# Altium project Cuk_3Ph_Control.PrjPcb
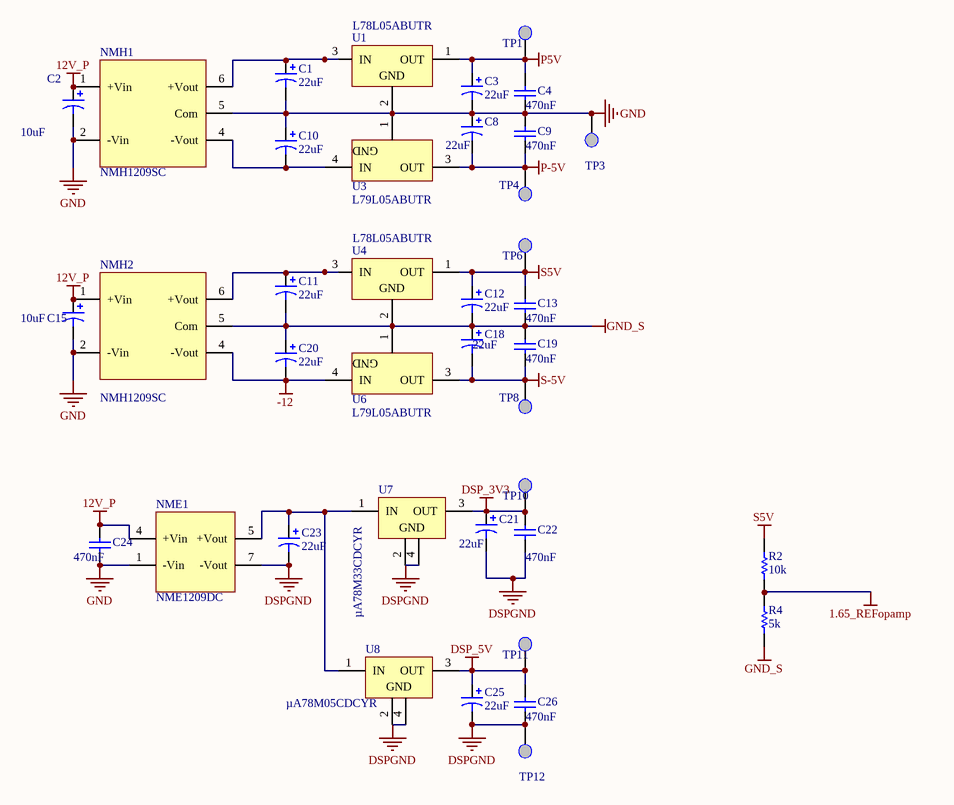
[diagram p0: CUK_3Ph_Power_Supplys.SchDoc]
5 sheets, 204 parts. Net scope: flat (ports and power ports of the same name join across sheets).
Board file: cuk_control_pcb_grid_connected.PcbDoc
Sheets:
  CUK_3Ph_Power_Supplys.SchDoc
  CUK_3Ph_sig_conditioner.SchDoc
  CUK_3Ph_Analog_Isolation.SchDoc
  DAC.SchDoc
  CUK_3Ph_dig_iso_interface.SchDoc

## Sheet CUK_3Ph_Power_Supplys.SchDoc: Cux GaN Grid connected control board
size A; Engineer: Ankit Gupta; Revision: V1.1

### Parts
C1  value 22uF  [Cap tantal 22u-25V]  (hidden comment: Tantalium)
C2  value 10uF  [CAP-10u-16V]  (hidden comment: electrolytic)
C3  value 22uF  [Cap Tantal 3216]  (hidden comment: Tantalium/T520A226M006ATE090)
C4  value 470nF  [Capacitor 0805]  (hidden comment: Cap)
C8  value 22uF  [Cap Tantal 3216]  (hidden comment: Tantalium/T520A226M006ATE090)
C9  value 470nF  [Capacitor 0805]  (hidden comment: Cap)
C10  value 22uF  [Cap tantal 22u-25V]  (hidden comment: Tantalium)
C11  value 22uF  [Cap tantal 22u-25V]  (hidden comment: Tantalium)
C12  value 22uF  [Cap Tantal 3216]  (hidden comment: Tantalium/T520A226M006ATE090)
C13  value 470nF  [Capacitor 0805]  (hidden comment: Cap)
C15  value 10uF  [Cap elec 10u/16V]  (hidden comment: electrolytic)
C18  value 22uF  [Cap Tantal 3216]  (hidden comment: Tantalium/T520A226M006ATE090)
C19  value 470nF  [Capacitor 0805]  (hidden comment: Cap)
C20  value 22uF  [Cap tantal 22u-25V]  (hidden comment: Tantalium)
C21  value 22uF  [Cap Tantal 3216]  (hidden comment: Tantalium/T520A226M006ATE090)
C22  value 470nF  [Capacitor 0805]  (hidden comment: Cap)
C23  value 22uF  [Cap tantal 22u-25V]  (hidden comment: Tantalium)
C24  value 470nF  [Capacitor 0805]  (hidden comment: Cap)
C25  value 22uF  [Cap Tantal 3216]  (hidden comment: Tantalium/T520A226M006ATE090)
C26  value 470nF  [Capacitor 0805]  (hidden comment: Cap)
NME1  NME1209DC  [NME1209DC]
NMH1  NMH1209SC  [NMH1209SC]
NMH2  NMH1209SC  [NMH1209SC]
R2  value 10k  [0805 RES]  (hidden comment: Res1)
R4  value 5k  [0805 RES]  (hidden comment: Res1)
TP1  Test point  [Test Point]  (value not drawn)
TP3  Test point  [Test Point]  (value not drawn)
TP4  Test point  [Test Point]  (value not drawn)
TP6  Test point  [Test Point]  (value not drawn)
TP8  Test point  [Test Point]  (value not drawn)
TP10  Test point  [Test Point]  (value not drawn)
TP11  Test point  [Test Point]  (value not drawn)
TP12  Test point  [Test Point]  (value not drawn)
U1  L78L05ABUTR  [Reg SOT-89 +5]
U3  L79L05ABUTR  [Reg SOT-89]
U4  L78L05ABUTR  [Reg SOT-89 +5]
U6  L79L05ABUTR  [Reg SOT-89]
U7  µA78M33CDCYR  [Reg - SOT223]
U8  µA78M05CDCYR  [Reg - SOT223]

### Nets
1.65_REFopamp: R2.1 R4.2
12V_P: C2.1 C15.1 C24.2 NME1.4(+Vin) NMH1.1(+Vin) NMH2.1(+Vin)
-12: C20.2 NMH2.4(-Vout) U6.4(IN)
DSP_3V3: C21.1 C22.2 TP10.1 U7.3(OUT)
DSP_5V: C25.1 C26.2 TP11.1 U8.3(OUT)
DSPGND: C21.2 C22.1 C23.2 C25.2 C26.1 NME1.7(-Vout) TP12.1 U7.2(GND) U7.4(GND) U8.2(GND) U8.4(GND)
GND: C1.2 C2.2 C3.2 C4.1 C8.1 C9.2 C10.1 C15.2 C24.1 NME1.1(-Vin) NMH1.2(-Vin) NMH1.5(Com) NMH2.2(-Vin) TP3.1 U1.2(GND) U3.1(GND)
GND_S: C11.2 C12.2 C13.1 C18.1 C19.2 C20.1 NMH2.5(Com) R4.1 U4.2(GND) U6.1(GND)
P5V: C3.1 C4.2 TP1.1 U1.1(OUT)
P-5V: C8.2 C9.1 TP4.1 U3.3(OUT)
S5V: C12.1 C13.2 R2.2 TP6.1 U4.1(OUT)
S-5V: C18.2 C19.1 TP8.1 U6.3(OUT)
NetC1_1: C1.1 NMH1.6(+Vout) U1.3(IN)
NetC10_2: C10.2 NMH1.4(-Vout) U3.4(IN)
NetC11_1: C11.1 NMH2.6(+Vout) U4.3(IN)
NetC23_1: C23.1 NME1.5(+Vout) U7.1(IN) U8.1(IN)

### Library data of the parts
C1-C3 C8 C10-C12 C15 C18 C20 C21 C23 C25 = Cap Pol1: Polarized Capacitor (Radial); Published: 8-Jun-2000; LatestRevisionDate: 17-Jul-2002; LatestRevisionNote: Re-released for DXP Platform.; PackageReference: RB7.6-15; Publisher: Altium Limited
C4 C9 C13 C19 C22 C24 C26 = Cap: Capacitor; Published: 8-Jun-2000; LatestRevisionDate: 17-Jul-2002; LatestRevisionNote: Re-released for DXP Platform.; PackageReference: RAD-0.3; Publisher: Altium Limited
NME1 = NME----DC
NMH1 = NMH----SC_1
NMH2 = NMH----SC
R2 R4 = Res1: Resistor; Published: 8-Jun-2000; LatestRevisionDate: 17-Jul-2002; LatestRevisionNote: Re-released for DXP Platform.; PackageReference: AXIAL-0.3; Publisher: Altium Limited
U1 U4 = L78L05ABZ: Positive Voltage Regulator; Published: 24-Aug-2001; LatestRevisionDate: 17-Jul-2002; LatestRevisionNote: Re-released for DXP Platform.; DatasheetVersion: Feb-1999; PackageReference: TO92; Publisher: Altium Limited; PackageDescription: TO, Flat Index; 3 In-Line, Axial Leads; Body Dia. 4.8mm; Leads 0.51 x 0.51 mm (max); ComponentLink1Description: Manufacturer Link; ComponentLink1URL: http://www.st.com/
U3 U6 = µA79M05CKTPR: Negative-Voltage Regulator; Note: Pin 2 is electrically connected to pin4, and not drawn.; Published: 15-Apr-2002; DatasheetVersion: Apr-2000; PackageVersion: Jan-2001; PackageReference: KTP02; Publisher: Altium Limited; PackageDescription: PowerFLEX (D-PAK/TO-252-AA); 3 Leads (1 Cropped); Body 9.7 (inc. leads) x 6.2 mm (LxW max); Code_JEDEC: TO-252; ComponentLink1Description: Manufacturer Link; ComponentLink1URL: http://www.ti.com/; ComponentLink2Description: Datasheet; ComponentLink2URL: http://www-s.ti.com/sc/ds/ua79m05.pdf
U7 U8 = µA7805CKTER: Positive-Voltage Regulator; Note: Pin 2 is electrically connected to TAB/Pin4.; Published: 15-Apr-2002; DatasheetVersion: Jul-1999; PackageVersion: Jan-2001; PackageReference: KTE03; Publisher: Altium Limited; PackageDescription: PowerFLEX; 3 Leads; Body 10.7 (inc. leads) x 9.5 mm (LxW max); Code_JEDEC: MO-169; ComponentLink1Description: Manufacturer Link; ComponentLink1URL: http://www.ti.com/; ComponentLink2Description: Datasheet; ComponentLink2URL: http://www-s.ti.com/sc/ds/ua7805.pdf

## Sheet CUK_3Ph_sig_conditioner.SchDoc
size A
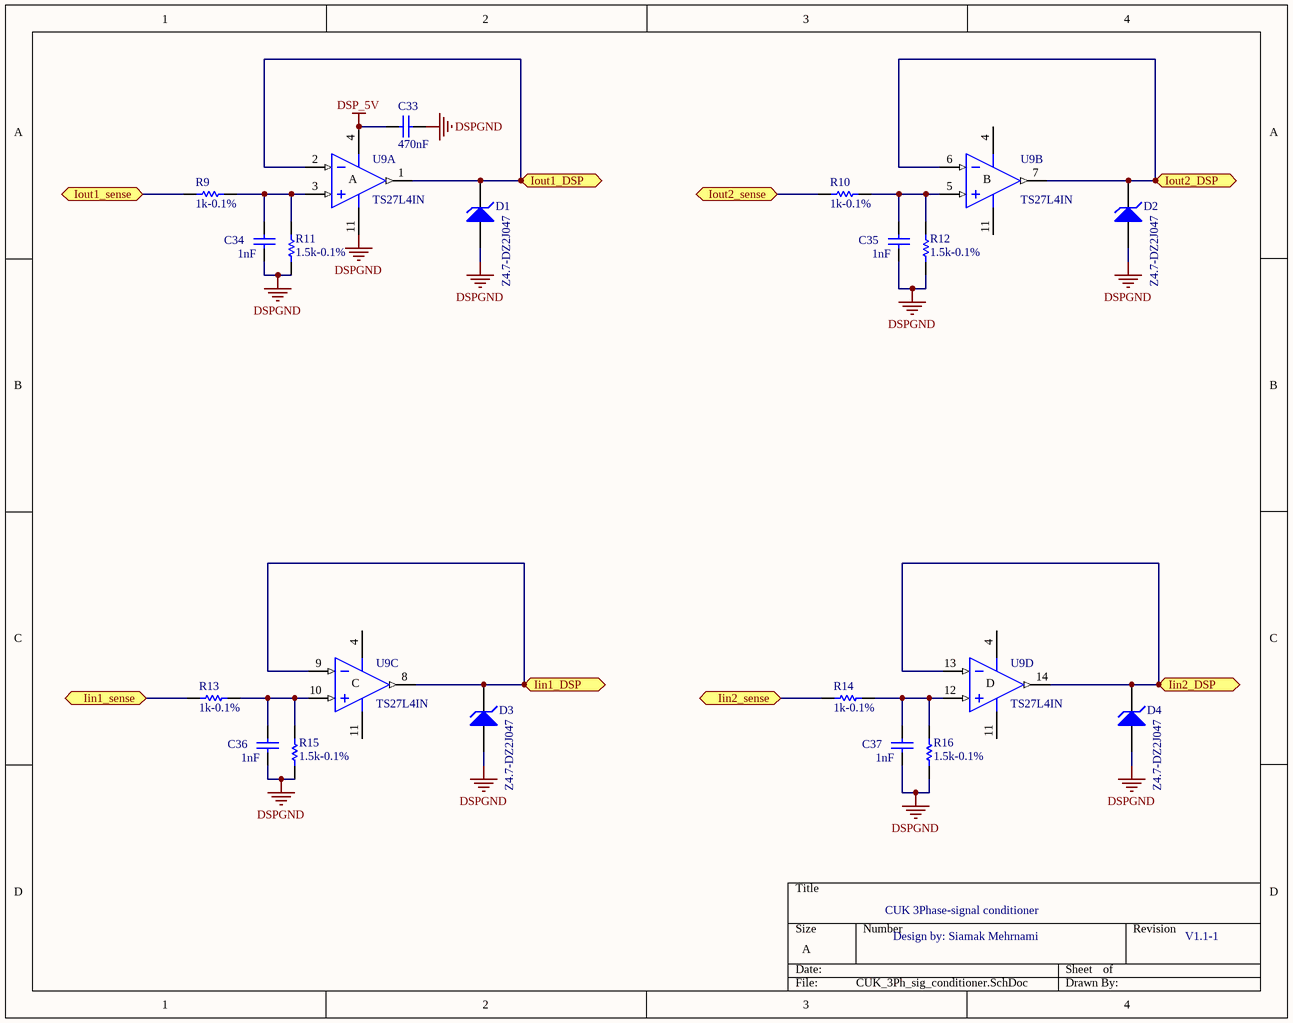
[diagram p1: CUK_3Ph_sig_conditioner.SchDoc]

### Parts
C33  value 470nF  [Capacitor 0805]  (hidden comment: Cap)
C34  value 1nF  [Capacitor 0805]  (hidden comment: Cap)
C35  value 1nF  [Capacitor 0805]  (hidden comment: Cap)
C36  value 1nF  [Capacitor 0805]  (hidden comment: Cap)
C37  value 1nF  [Capacitor 0805]  (hidden comment: Cap)
D1  Z4.7-DZ2J047  [Zener DZ2J047]
D2  Z4.7-DZ2J047  [Zener DZ2J047]
D3  Z4.7-DZ2J047  [Zener DZ2J047]
D4  Z4.7-DZ2J047  [Zener DZ2J047]
R9  value 1k-0.1%  [0805 RES]  (hidden comment: Res1)
R10  value 1k-0.1%  [0805 RES]  (hidden comment: Res1)
R11  value 1.5k-0.1%  [0805 RES]  (hidden comment: Res1)
R12  value 1.5k-0.1%  [0805 RES]  (hidden comment: Res1)
R13  value 1k-0.1%  [0805 RES]  (hidden comment: Res1)
R14  value 1k-0.1%  [0805 RES]  (hidden comment: Res1)
R15  value 1.5k-0.1%  [0805 RES]  (hidden comment: Res1)
R16  value 1.5k-0.1%  [0805 RES]  (hidden comment: Res1)
U9  TS27L4IN  [DIP14]  (parts A,B,C,D of 4)

### Ports
Iin1_DSP, Iin1_sense, Iin2_DSP, Iin2_sense, Iout1_DSP, Iout1_sense (bidir), Iout2_DSP, Iout2_sense (bidir)

### Nets
DSP_5V: C33.2 U9.4(V+)
DSPGND: C33.1 C34.1 C35.1 C36.1 C37.1 D1.1(A) D2.1(A) D3.1(A) D4.1(A) R11.1 R12.1 R15.1 R16.1 U9.11(V-)
NetC34_2: C34.2 R9.1 R11.2 U9.3(IN+)
NetC35_2: C35.2 R10.1 R12.2 U9.5(IN+)
NetC36_2: C36.2 R13.1 R15.2 U9.10(IN+)
NetC37_2: C37.2 R14.1 R16.2 U9.12(IN+)
NetD1_2: D1.2(K) U9.1(OUT) U9.2(IN-) ; port Iout1_DSP
NetD2_2: D2.2(K) U9.6(IN-) U9.7(OUT) ; port Iout2_DSP
NetD3_2: D3.2(K) U9.8(OUT) U9.9(IN-) ; port Iin1_DSP
NetD4_2: D4.2(K) U9.13(IN-) U9.14(OUT) ; port Iin2_DSP
NetP2_5: R13.2 ; port Iin1_sense
NetP2_7: R14.2 ; port Iin2_sense
NetP2_9: R9.2 ; port Iout1_sense
NetP2_11: R10.2 ; port Iout2_sense

### Notes on the sheet
- CUK 3Phase-signal conditioner
- Design by: Siamak Mehrnami
- V1.1-1
- (in symbol TS27L4AMD, part A) A
- (in symbol TS27L4AMD, part B) B
- (in symbol TS27L4AMD, part C) C
- (in symbol TS27L4AMD, part D) D

### Library data of the parts
C33-C37 = Cap: Capacitor; Published: 8-Jun-2000; LatestRevisionDate: 17-Jul-2002; LatestRevisionNote: Re-released for DXP Platform.; PackageReference: RAD-0.3; Publisher: Altium Limited
D1-D4 = D Zener: Zener Diode; Published: 8-Jun-2000; LatestRevisionDate: 17-Jul-2002; LatestRevisionNote: Re-released for DXP Platform.; PackageReference: DIODE-0.7; Publisher: Altium Limited
R9-R16 = Res1: Resistor; Published: 8-Jun-2000; LatestRevisionDate: 17-Jul-2002; LatestRevisionNote: Re-released for DXP Platform.; PackageReference: AXIAL-0.3; Publisher: Altium Limited
U9 = TS27L4AMD: Very Low-Power CMOS Quad Operational Amplifier; Published: 24-Aug-2001; LatestRevisionDate: 13-Apr-2006; LatestRevisionNote: IPC-7351 Footprint Added.; DatasheetVersion: Nov-1998; PackageVersion: Sep-1998; PackageReference: SO14; Publisher: Altium Limited; PackageDescription: 14-Pin Small Outline Integrated Circuit 1.27 mm Pitch; Code_IPC: SOIC127P600-14; ComponentLink1Description: Manufacturer Link; ComponentLink1URL: http://www.st.com/; ComponentLink2Description: Datasheet; ComponentLink2URL: http://www.st.com/stonline/products/literature/ds/2305/ts27l4.pdf

## Sheet CUK_3Ph_Analog_Isolation.SchDoc
size A3
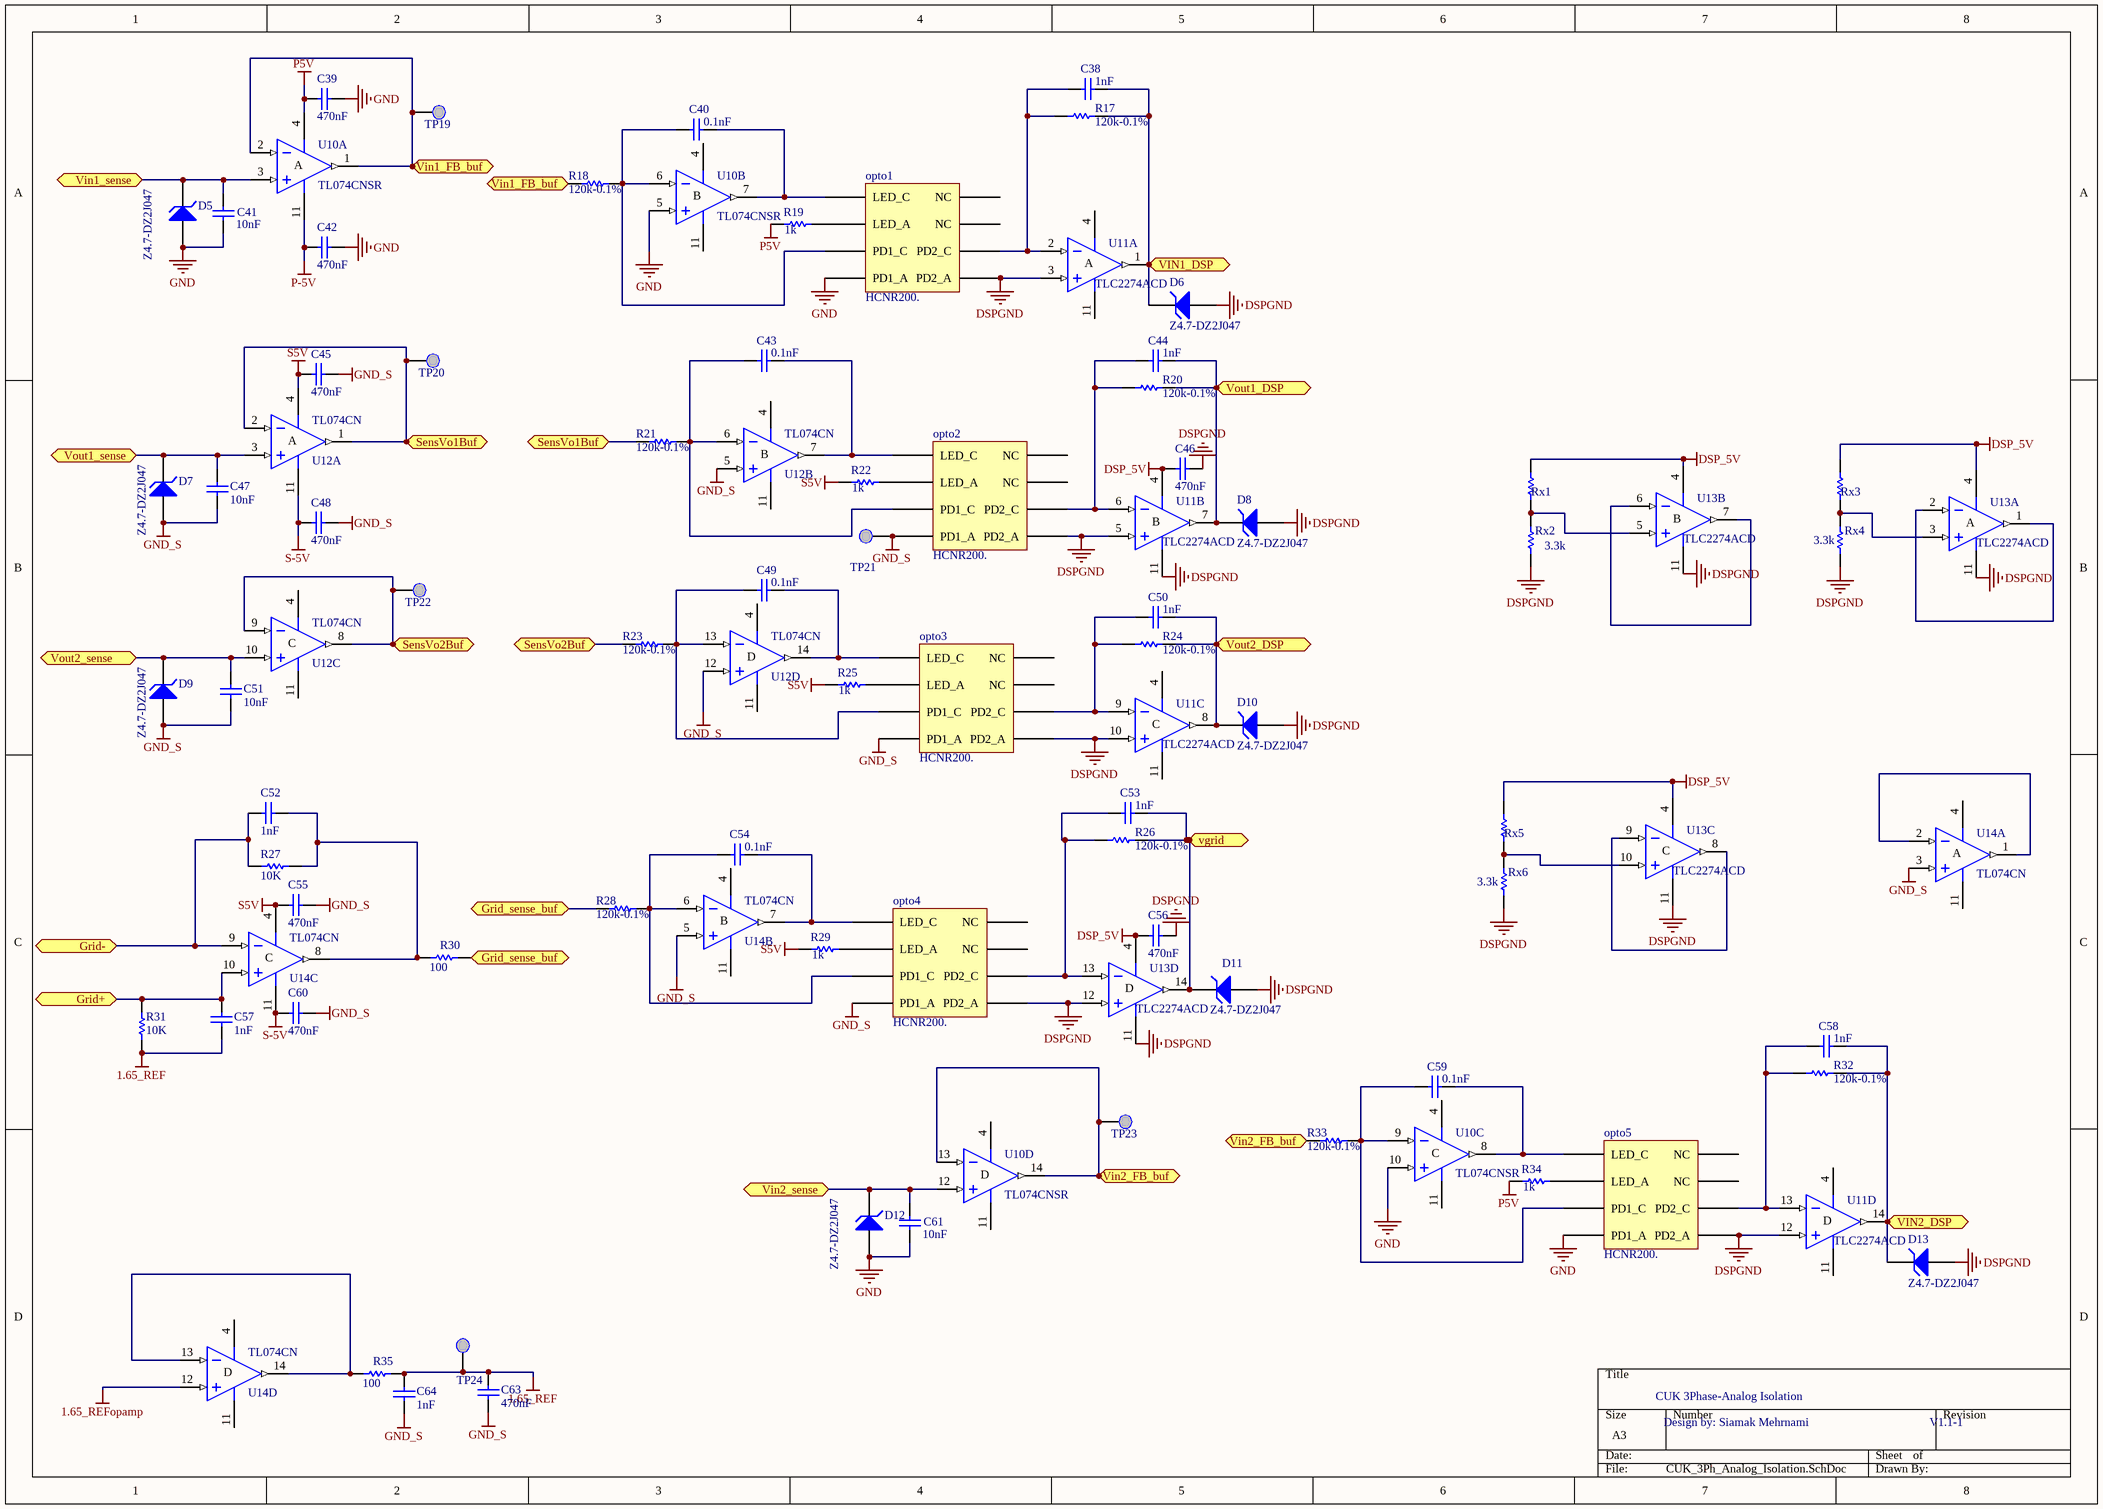
[diagram p2: CUK_3Ph_Analog_Isolation.SchDoc]

### Parts
C38  value 1nF  [Capacitor 0805]  (hidden comment: Cap)
C39  value 470nF  [Capacitor 0805]  (hidden comment: Cap)
C40  value 0.1nF  [Capacitor 0805]  (hidden comment: Cap)
C41  value 10nF  [Capacitor 0805]  (hidden comment: Cap)
C42  value 470nF  [Capacitor 0805]  (hidden comment: Cap)
C43  value 0.1nF  [Capacitor 0805]  (hidden comment: Cap)
C44  value 1nF  [Capacitor 0805]  (hidden comment: Cap)
C45  value 470nF  [Capacitor 0805]  (hidden comment: Cap)
C46  value 470nF  [Capacitor 0805]  (hidden comment: Cap)
C47  value 10nF  [Capacitor 0805]  (hidden comment: Cap)
C48  value 470nF  [Capacitor 0805]  (hidden comment: Cap)
C49  value 0.1nF  [Capacitor 0805]  (hidden comment: Cap)
C50  value 1nF  [Capacitor 0805]  (hidden comment: Cap)
C51  value 10nF  [Capacitor 0805]  (hidden comment: Cap)
C52  value 1nF  [Capacitor 0805]  (hidden comment: Cap)
C53  value 1nF  [Capacitor 0805]  (hidden comment: Cap)
C54  value 0.1nF  [Capacitor 0805]  (hidden comment: Cap)
C55  value 470nF  [Capacitor 0805]  (hidden comment: Cap)
C56  value 470nF  [Capacitor 0805]  (hidden comment: Cap)
C57  value 1nF  [Capacitor 0805]  (hidden comment: Cap)
C58  value 1nF  [Capacitor 0805]  (hidden comment: Cap)
C59  value 0.1nF  [Capacitor 0805]  (hidden comment: Cap)
C60  value 470nF  [Capacitor 0805]  (hidden comment: Cap)
C61  value 10nF  [Capacitor 0805]  (hidden comment: Cap)
C63  value 470nF  [Capacitor 0805]  (hidden comment: Cap)
C64  value 1nF  [Capacitor 0805]  (hidden comment: Cap)
D5  Z4.7-DZ2J047  [Zener DZ2J047]
D6  Z4.7-DZ2J047  [Zener DZ2J047]
D7  Z4.7-DZ2J047  [Zener DZ2J047]
D8  Z4.7-DZ2J047  [Zener DZ2J047]
D9  Z4.7-DZ2J047  [Zener DZ2J047]
D10  Z4.7-DZ2J047  [Zener DZ2J047]
D11  Z4.7-DZ2J047  [Zener DZ2J047]
D12  Z4.7-DZ2J047  [Zener DZ2J047]
D13  Z4.7-DZ2J047  [Zener DZ2J047]
opto1  HCNR200.  [HCNR200]
opto2  HCNR200.  [HCNR200]
opto3  HCNR200.  [HCNR200]
opto4  HCNR200.  [HCNR200]
opto5  HCNR200.  [HCNR200]
R17  value 120k-0.1%  [0805 RES]  (hidden comment: Res1)
R18  value 120k-0.1%  [0805 RES]  (hidden comment: Res1)
R19  value 1k  [0805 RES]  (hidden comment: Res1)
R20  value 120k-0.1%  [0805 RES]  (hidden comment: Res1)
R21  value 120k-0.1%  [0805 RES]  (hidden comment: Res1)
R22  value 1k  [0805 RES]  (hidden comment: Res1)
R23  value 120k-0.1%  [0805 RES]  (hidden comment: Res1)
R24  value 120k-0.1%  [0805 RES]  (hidden comment: Res1)
R25  value 1k  [0805 RES]  (hidden comment: Res1)
R26  value 120k-0.1%  [0805 RES]  (hidden comment: Res1)
R27  value 10K  [0805 RES]  (hidden comment: Res1)
R28  value 120k-0.1%  [0805 RES]  (hidden comment: Res1)
R29  value 1k  [0805 RES]  (hidden comment: Res1)
R30  value 100  [0805 RES]  (hidden comment: Res1)
R31  value 10K  [0805 RES]  (hidden comment: Res1)
R32  value 120k-0.1%  [0805 RES]  (hidden comment: Res1)
R33  value 120k-0.1%  [0805 RES]  (hidden comment: Res1)
R34  value 1k  [0805 RES]  (hidden comment: Res1)
R35  value 100  [0805 RES]  (hidden comment: Res1)
Rx1  Res1  [0805 RES]  (value not drawn)
Rx2  value 3.3k  [0805 RES]  (hidden comment: Res1)
Rx3  Res1  [0805 RES]  (value not drawn)
Rx4  value 3.3k  [0805 RES]  (hidden comment: Res1)
Rx5  Res1  [0805 RES]  (value not drawn)
Rx6  value 3.3k  [0805 RES]  (hidden comment: Res1)
TP19  Test point  [Test Point]  (value not drawn)
TP20  Test point  [Test Point]  (value not drawn)
TP21  Test point  [Test Point]  (value not drawn)
TP22  Test point  [Test Point]  (value not drawn)
TP23  Test point  [Test Point]  (value not drawn)
TP24  Test point  [Test Point]  (value not drawn)
U10  TL074CNSR  [DIP14]  (parts A,B,C,D of 4)
U11  TLC2274ACD  [SOIC14]  (parts A,B,C,D of 4)
U12  TL074CN  [DIP14]  (parts A,B,C,D of 4)
U13  TLC2274ACD  [SOIC14]  (parts A,B,C,D of 4)
U14  TL074CN  [DIP14]  (parts A,B,C,D of 4)

### Ports
Grid+ (bidir), Grid- (bidir), Grid_sense_buf, SensVo1Buf, SensVo2Buf, vgrid, VIN1_DSP, Vin1_FB_buf, Vin1_sense, VIN2_DSP, Vin2_FB_buf, Vin2_sense, Vout1_DSP, Vout1_sense, Vout2_DSP, Vout2_sense

### Nets
1.65_REF: C57.2 C63.1 C64.1 R31.1 R35.1 TP24.1
1.65_REFopamp: U14.12(IN+)
DSP_5V: C46.2 C56.2 Rx1.2 Rx3.2 Rx5.2 U11.4(V+) U13.4(V+)
DSPGND: C46.1 C56.1 D6.1(A) D8.1(A) D10.1(A) D11.1(A) D13.1(A) opto1.5(PD2_A) opto2.5(PD2_A) opto3.5(PD2_A) opto4.5(PD2_A) opto5.5(PD2_A) Rx2.1 Rx4.1 Rx6.1 U11.3(IN+) U11.5(IN+) U11.10(IN+) U11.11(V-) U11.12(IN+) U13.11(V-) U13.12(IN+)
GND: C39.1 C41.2 C42.1 C61.2 D5.1(A) D12.1(A) opto1.4(PD1_A) opto5.4(PD1_A) U10.5(IN+) U10.10(IN+)
GND_S: C45.1 C47.2 C48.1 C51.2 C55.1 C60.1 C63.2 C64.2 D7.1(A) D9.1(A) opto2.4(PD1_A) opto3.4(PD1_A) opto4.4(PD1_A) TP21.1 U12.5(IN+) U12.12(IN+) U14.3(IN+) U14.5(IN+)
P5V: C39.2 R19.1 R34.1 U10.4(V+)
P-5V: C42.2 U10.11(V-)
S5V: C45.2 C55.2 R22.1 R25.1 R29.1 U12.4(V+) U14.4(V+)
S-5V: C48.2 C60.2 U12.11(V-) U14.11(V-)
NetC38_1: C38.1 opto1.6(PD2_C) R17.1 U11.2(IN-)
NetC38_2: C38.2 D6.2(K) R17.2 U11.1(OUT) ; port VIN1_DSP
NetC40_1: C40.1 opto1.3(PD1_C) R18.2 U10.6(IN-)
NetC40_2: C40.2 opto1.1(LED_C) U10.7(OUT)
NetC41_1: C41.1 D5.2(K) U10.3(IN+) ; port Vin1_sense
NetC43_1: C43.1 opto2.3(PD1_C) R21.2 U12.6(IN-)
NetC43_2: C43.2 opto2.1(LED_C) U12.7(OUT)
NetC44_1: C44.1 opto2.6(PD2_C) R20.1 U11.6(IN-)
NetC44_2: C44.2 D8.2(K) R20.2 U11.7(OUT) ; port Vout1_DSP
NetC47_1: C47.1 D7.2(K) U12.3(IN+) ; port Vout1_sense
NetC49_1: C49.1 opto3.3(PD1_C) R23.2 U12.13(IN-)
NetC49_2: C49.2 opto3.1(LED_C) U12.14(OUT)
NetC50_1: C50.1 opto3.6(PD2_C) R24.1 U11.9(IN-)
NetC50_2: C50.2 D10.2(K) R24.2 U11.8(OUT) ; port Vout2_DSP
NetC51_1: C51.1 D9.2(K) U12.10(IN+) ; port Vout2_sense
NetC52_1: C52.1 R27.2 U14.9(IN-) ; port Grid-
NetC52_2: C52.2 R27.1 R30.2 U14.8(OUT)
NetC53_1: C53.1 opto4.6(PD2_C) R26.1 U13.13(IN-)
NetC53_2: C53.2 D11.2(K) R26.2 U13.14(OUT) ; port vgrid
NetC54_1: C54.1 opto4.3(PD1_C) R28.2 U14.6(IN-)
NetC54_2: C54.2 opto4.1(LED_C) U14.7(OUT)
NetC57_1: C57.1 R31.2 U14.10(IN+) ; port Grid+
NetC58_1: C58.1 opto5.6(PD2_C) R32.1 U11.13(IN-)
NetC58_2: C58.2 D13.2(K) R32.2 U11.14(OUT) ; port VIN2_DSP
NetC59_1: C59.1 opto5.3(PD1_C) R33.2 U10.9(IN-)
NetC59_2: C59.2 opto5.1(LED_C) U10.8(OUT)
NetC61_1: C61.1 D12.2(K) U10.12(IN+) ; port Vin2_sense
Netopto1_2: opto1.2(LED_A) R19.2
Netopto2_2: opto2.2(LED_A) R22.2
Netopto3_2: opto3.2(LED_A) R25.2
Netopto4_2: opto4.2(LED_A) R29.2
Netopto5_2: opto5.2(LED_A) R34.2
NetR18_1: R18.1 TP19.1 U10.1(OUT) U10.2(IN-) ; port Vin1_FB_buf
NetR21_1: R21.1 TP20.1 U12.1(OUT) U12.2(IN-) ; port SensVo1Buf
NetR23_1: R23.1 TP22.1 U12.8(OUT) U12.9(IN-) ; port SensVo2Buf
NetR28_1: R28.1 R30.1 ; port Grid_sense_buf
NetR33_1: R33.1 TP23.1 U10.13(IN-) U10.14(OUT) ; port Vin2_FB_buf
NetR35_2: R35.2 U14.13(IN-) U14.14(OUT)
NetRx1_1: Rx1.1 Rx2.2 U13.5(IN+)
NetRx3_1: Rx3.1 Rx4.2 U13.3(IN+)
NetRx5_1: Rx5.1 Rx6.2 U13.10(IN+)
NetU13_1: U13.1(OUT) U13.2(IN-)
NetU13_6: U13.6(IN-) U13.7(OUT)
NetU13_8: U13.8(OUT) U13.9(IN-)
NetU14_1: U14.1(OUT) U14.2(IN-)

Not connected (* = marked no-connect by the designer): opto1 7(NC) 8(NC); opto2 7(NC) 8(NC); opto3 7(NC) 8(NC); opto4 7(NC) 8(NC); opto5 7(NC) 8(NC)

### Notes on the sheet
- CUK 3Phase-Analog Isolation
- Design by: Siamak Mehrnami
- V1.1-1
- (in symbol TL074J, part A) A
- (in symbol TL074J, part B) B
- (in symbol TL074J, part C) C
- (in symbol TL074J, part D) D
- (in symbol TS27L4AMD, part A) A
- (in symbol TS27L4AMD, part B) B
- (in symbol TS27L4AMD, part C) C
- (in symbol TS27L4AMD, part D) D

### Library data of the parts
C38-C61 C63 C64 = Cap: Capacitor; Published: 8-Jun-2000; LatestRevisionDate: 17-Jul-2002; LatestRevisionNote: Re-released for DXP Platform.; PackageReference: RAD-0.3; Publisher: Altium Limited
D5-D13 = D Zener: Zener Diode; Published: 8-Jun-2000; LatestRevisionDate: 17-Jul-2002; LatestRevisionNote: Re-released for DXP Platform.; PackageReference: DIODE-0.7; Publisher: Altium Limited
opto1-opto5 = Component_1
R17-R35 Rx1-Rx6 = Res1: Resistor; Published: 8-Jun-2000; Publisher: Altium Limited
  R17-R35: LatestRevisionDate: 17-Jul-2002; LatestRevisionNote: Re-released for DXP Platform.; PackageReference: AXIAL-0.3
  Rx1-Rx6: Revision: July-2002: Re-released for DXP Platform.
U10 U12 U14 = TL074J: Low-Noise JFET-Input Operational Amplifier; Published: 16-Jan-2001; LatestRevisionDate: 04-Mar-2005; LatestRevisionNote: Stylized 3D Model Added.; DatasheetVersion: Aug-1996; PackageVersion: Jun-1999; PackageReference: J014; Publisher: Altium Limited; PackageDescription: DIP; 14 Leads; Row Spacing 7.62 mm; Pitch 2.54 mm; ComponentLink1Description: Manufacturer Link; ComponentLink1URL: http://www.ti.com/; ComponentLink2Description: Datasheet; ComponentLink2URL: http://www-s.ti.com/sc/ds/tl074.pdf
U11 U13 = TS27L4AMD: as U9 on sheet CUK_3Ph_sig_conditioner; Published: 24-Aug-2001; LatestRevisionDate: 13-Apr-2006; LatestRevisionNote: IPC-7351 Footprint Added.; DatasheetVersion: Nov-1998; PackageVersion: Sep-1998; PackageReference: SO14; Publisher: Altium Limited; PackageDescription: 14-Pin Small Outline Integrated Circuit 1.27 mm Pitch; Code_IPC: SOIC127P600-14; ComponentLink1Description: Manufacturer Link; ComponentLink1URL: http://www.st.com/; ComponentLink2Description: Datasheet; ComponentLink2URL: http://www.st.com/stonline/products/literature/ds/2305/ts27l4.pdf

## Sheet DAC.SchDoc
size A
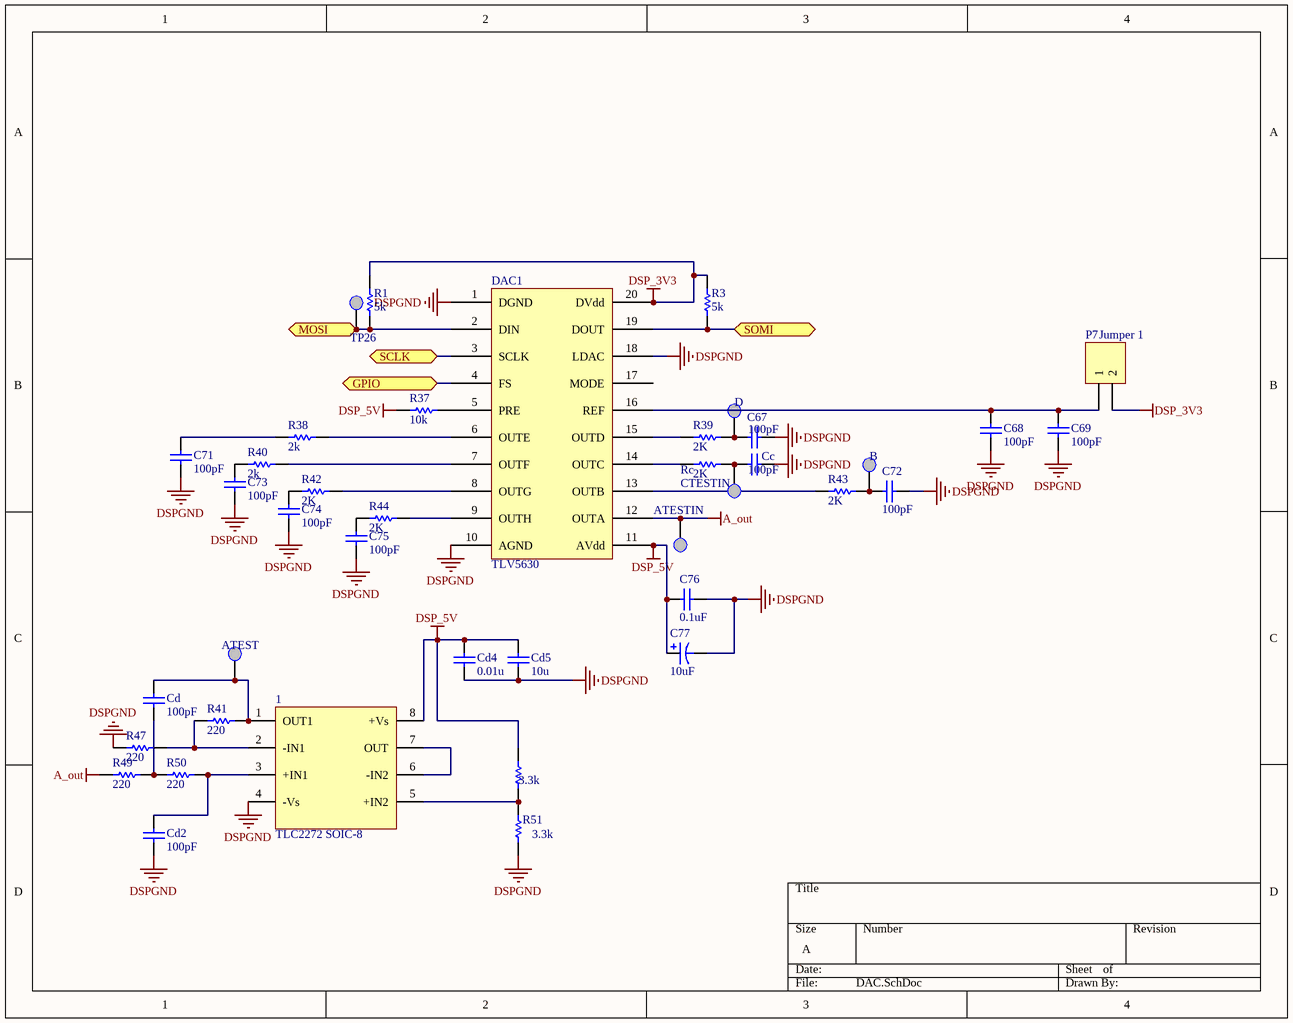
[diagram p3: DAC.SchDoc]

### Parts
1  TLC2272 SOIC-8  [AD8056]
3.3k  Res1  [0805 RES]  (value not drawn)
ATEST  Test point  [Test Point]  (value not drawn)
ATESTIN  Test point  [Test Point]  (value not drawn)
B  Test point  [Test Point]  (value not drawn)
C67  value 100pF  [Capacitor 0805]  (hidden comment: Cap)
C68  value 100pF  [Capacitor 0805]  (hidden comment: Cap)
C69  value 100pF  [Capacitor 0805]  (hidden comment: Cap)
C71  value 100pF  [Capacitor 0805]  (hidden comment: Cap)
C72  value 100pF  [Capacitor 0805]  (hidden comment: Cap)
C73  value 100pF  [Capacitor 0805]  (hidden comment: Cap)
C74  value 100pF  [Capacitor 0805]  (hidden comment: Cap)
C75  value 100pF  [Capacitor 0805]  (hidden comment: Cap)
C76  value 0.1uF  [Capacitor 0805]  (hidden comment: Cap)
C77  value 10uF  [Cap Tantal 3216]  (hidden comment: Tantalium/T520A226M006ATE090)
Cc  value 100pF  [Capacitor 0805]  (hidden comment: Cap)
Cd  value 100pF  [Capacitor 0805]  (hidden comment: Cap)
Cd2  value 100pF  [Capacitor 0805]  (hidden comment: Cap)
Cd4  value 0.01u  [Capacitor 0805]  (hidden comment: Cap)
Cd5  value 10u  [Capacitor 0805]  (hidden comment: Cap)
CTESTIN  Test point  [Test Point]  (value not drawn)
D  Test point  [Test Point]  (value not drawn)
DAC1  TLV5630  [TLV5630]
P7  Jumper 1  [HDR1X2]
R1  value 5k  [0805 RES]  (hidden comment: Res1)
R3  value 5k  [0805 RES]  (hidden comment: Res1)
R37  value 10k  [0805 RES]  (hidden comment: Res1)
R38  value 2k  [0805 RES]  (hidden comment: Res1)
R39  value 2K  [0805 RES]  (hidden comment: Res1)
R40  value 2k  [0805 RES]  (hidden comment: Res1)
R41  value 220  [0805 RES]  (hidden comment: Res1)
R42  value 2K  [0805 RES]  (hidden comment: Res1)
R43  value 2K  [0805 RES]  (hidden comment: Res1)
R44  value 2K  [0805 RES]  (hidden comment: Res1)
R47  value 220  [0805 RES]  (hidden comment: Res1)
R49  value 220  [0805 RES]  (hidden comment: Res1)
R50  value 220  [0805 RES]  (hidden comment: Res1)
R51  value 3.3k  [0805 RES]  (hidden comment: Res1)
Rc  value 2K  [0805 RES]  (hidden comment: Res1)
TP26  Test point  [Test Point]  (value not drawn)

### Ports
GPIO, MOSI, SCLK, SOMI

### Nets
A_out: ATESTIN.1 DAC1.12(OUTA) R49.1
DSP_3V3: DAC1.20(DVdd) P7.2 R1.2 R3.2
DSP_5V: 1.8(+Vs) 3.3k.2 C76.2 C77.1 Cd4.1 Cd5.1 DAC1.11(AVdd) R37.1
DSPGND: 1.4(-Vs) C67.2 C68.2 C69.2 C71.2 C72.2 C73.2 C74.2 C75.2 C76.1 C77.2 Cc.2 Cd2.2 Cd4.2 Cd5.2 DAC1.1(DGND) DAC1.10(AGND) DAC1.18(LDAC) R47.1 R51.1
x1: DAC1.3(SCLK) ; port SCLK
Net1_1: 1.1(OUT1) ATEST.1 Cd.1 R41.2
Net1_2: 1.2(-IN1) R41.1 R47.2
Net1_3: 1.3(+IN1) Cd2.1 R50.2
Net1_5: 1.5(+IN2) 3.3k.1 R51.2
Net1_6: 1.6(-IN2) 1.7(OUT)
NetB_1: B.1 C72.1 R43.2
NetC67_1: C67.1 D.1 R39.2
NetC68_1: C68.1 C69.1 DAC1.16(REF) P7.1
NetC71_1: C71.1 R38.1
NetC73_1: C73.1 R40.1
NetC74_1: C74.1 R42.2
NetC75_1: C75.1 R44.2
NetCc_1: Cc.1 CTESTIN.1 Rc.2
NetCd_2: Cd.2 R49.2 R50.1
NetDAC1_2: DAC1.2(DIN) R1.1 TP26.1 ; port MOSI
NetDAC1_4: DAC1.4(FS) ; port GPIO
NetDAC1_5: DAC1.5(PRE) R37.2
NetDAC1_6: DAC1.6(OUTE) R38.2
NetDAC1_7: DAC1.7(OUTF) R40.2
NetDAC1_8: DAC1.8(OUTG) R42.1
NetDAC1_9: DAC1.9(OUTH) R44.1
NetDAC1_13: DAC1.13(OUTB) R43.1
NetDAC1_14: DAC1.14(OUTC) Rc.1
NetDAC1_15: DAC1.15(OUTD) R39.1
NetDAC1_19: DAC1.19(DOUT) R3.1 ; port SOMI

Not connected (* = marked no-connect by the designer): DAC1 17(MODE)

### Library data of the parts
1 = AD8056
3.3k R1 R3 R37-R44 R47 R49-R51 Rc = Res1: Resistor; Published: 8-Jun-2000; Revision: July-2002: Re-released for DXP Platform.; Publisher: Altium Limited
C67-C69 C71-C76 Cc Cd Cd2 Cd4 Cd5 = Cap: Capacitor; Published: 8-Jun-2000; LatestRevisionDate: 17-Jul-2002; LatestRevisionNote: Re-released for DXP Platform.; PackageReference: RAD-0.3; Publisher: Altium Limited
C77 = Cap Pol1: Polarized Capacitor (Radial); Published: 8-Jun-2000; LatestRevisionDate: 17-Jul-2002; LatestRevisionNote: Re-released for DXP Platform.; PackageReference: RB7.6-15; Publisher: Altium Limited
P7 = Header 2: Header, 2-Pin; LatestRevisionDate: 17-Jul-2002; LatestRevisionNote: Re-released for DXP Platform.; Publisher: Altium Limited

## Sheet CUK_3Ph_dig_iso_interface.SchDoc
size A
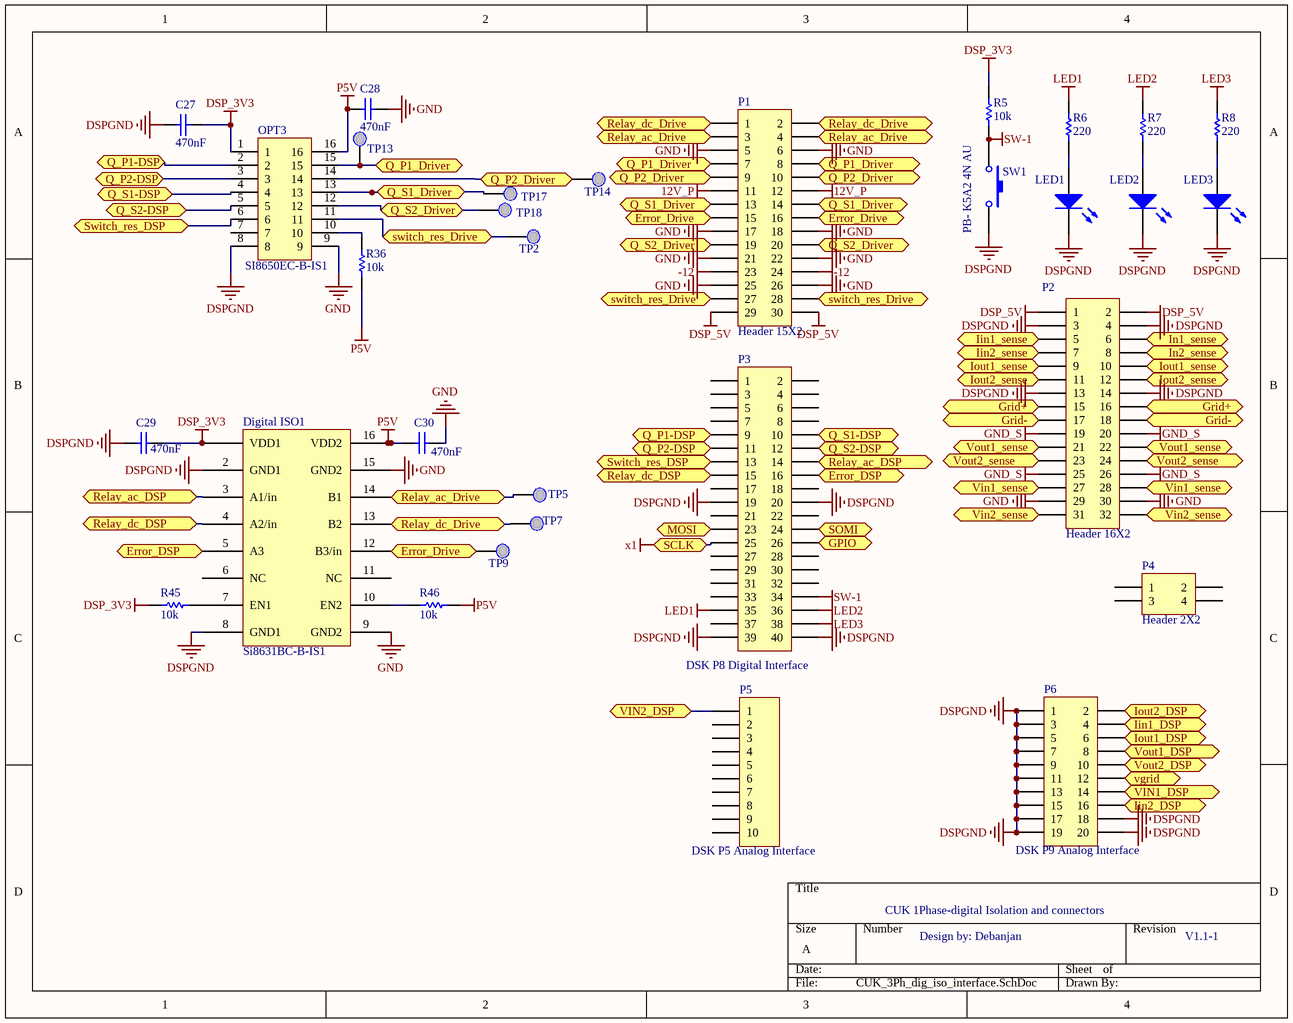
[diagram p4: CUK_3Ph_dig_iso_interface.SchDoc]

### Parts
C27  value 470nF  [Capacitor 0805]  (hidden comment: Cap)
C28  value 470nF  [Capacitor 0805]  (hidden comment: Cap)
C29  value 470nF  [Capacitor 0805]  (hidden comment: Cap)
C30  value 470nF  [Capacitor 0805]  (hidden comment: Cap)
Digital_ISO1  Si8631BC-B-IS1  [SOIC16 Narrow width]
LED1  ON  [LED 0805]  (value not drawn)
LED2  ON  [LED 0805]  (value not drawn)
LED3  ON  [LED 0805]  (value not drawn)
OPT3  SI8650EC-B-IS1  [SOIC16pin]
P1  Header 15X2  [HDR2X15]
P2  Header 16X2  [HDR2X16]
P3  DSK P8 Digital Interface  [HDR2X20]
P4  Header 2X2  [HDR2X2]
P5  DSK P5 Analog Interface  [HDR1X10]
P6  DSK P9 Analog Interface  [HDR2X10]
R5  value 10k  [0805 RES]  (hidden comment: Res1)
R6  value 220  [0805 RES]  (hidden comment: Res1)
R7  value 220  [0805 RES]  (hidden comment: Res1)
R8  value 220  [0805 RES]  (hidden comment: Res1)
R36  value 10k  [0805 RES]  (hidden comment: Res1)
R45  value 10k  [0805 RES]  (hidden comment: Res1)
R46  value 10k  [0805 RES]  (hidden comment: Res1)
SW1  PB- K5A2 4N AU  [push button]
TP2  Test point  [Test Point]  (value not drawn)
TP5  Test point  [Test Point]  (value not drawn)
TP7  Test point  [Test Point]  (value not drawn)
TP9  Test point  [Test Point]  (value not drawn)
TP13  Test point  [Test Point]  (value not drawn)
TP14  Test point  [Test Point]  (value not drawn)
TP17  Test point  [Test Point]  (value not drawn)
TP18  Test point  [Test Point]  (value not drawn)

### Ports
Error_Drive (bidir), Error_DSP (bidir), GPIO, Grid+, Grid-, Iin1_DSP, Iin1_sense, Iin2_DSP, Iin2_sense, In1_sense, In2_sense, Iout1_DSP, Iout1_sense, Iout1_sense (bidir), Iout2_DSP, Iout2_sense (bidir), MOSI, Q_P1-DSP, Q_P1_Driver, Q_P2-DSP, Q_P2_Driver, Q_S1-DSP, Q_S1_Driver, Q_S2-DSP, Q_S2_Driver, Relay_ac_Drive, Relay_ac_DSP, Relay_dc_Drive, Relay_dc_DSP, SCLK, SOMI, switch_res_Drive, Switch_res_DSP, vgrid (bidir), VIN1_DSP, Vin1_sense, VIN2_DSP, Vin2_sense, Vout1_DSP, Vout1_sense, Vout2_DSP, Vout2_sense

### Nets
12V_P: P1.11 P1.12
-12: P1.23 P1.24
DSP_3V3: C27.1 C29.1 Digital_ISO1.1(VDD1) OPT3.1 R5.1 R45.1
DSP_5V: P1.29 P1.30 P2.1 P2.2
DSPGND: C27.2 C29.2 Digital_ISO1.2(GND1) Digital_ISO1.8(GND1) LED1.2(K) LED2.2(K) LED3.2(K) OPT3.8 P2.3 P2.4 P2.13 P2.14 P3.19 P3.20 P3.39 P3.40 P6.1 P6.3 P6.5 P6.7 P6.9 P6.11 P6.13 P6.15 P6.17 P6.18 P6.19 P6.20 SW1.2
GND: C28.2 C30.2 Digital_ISO1.9(GND2) Digital_ISO1.15(GND2) OPT3.9 P1.5 P1.6 P1.17 P1.18 P1.21 P1.22 P1.25 P1.26 P2.29 P2.30
GND_S: P2.19 P2.20 P2.25 P2.26
LED1: P3.35 R6.1
LED2: P3.36 R7.1
LED3: P3.38 R8.1
P5V: C28.1 C30.1 Digital_ISO1.16(VDD2) OPT3.16 R36.1 R46.2
SW-1: P3.34 R5.2 SW1.1
x1: P3.25 ; port SCLK
NetC38_2: P6.14 ; port VIN1_DSP
NetC41_1: P2.27 P2.28 ; port Vin1_sense
NetC44_2: P6.8 ; port Vout1_DSP
NetC47_1: P2.21 P2.22 ; port Vout1_sense
NetC50_2: P6.10 ; port Vout2_DSP
NetC51_1: P2.23 P2.24 ; port Vout2_sense
NetC52_1: P2.17 P2.18 ; port Grid-
NetC53_2: P6.12 ; port vgrid
NetC57_1: P2.15 P2.16 ; port Grid+
NetC58_2: P5.1 ; port VIN2_DSP
NetC61_1: P2.31 P2.32 ; port Vin2_sense
NetD1_2: P6.6 ; port Iout1_DSP
NetD2_2: P6.2 ; port Iout2_DSP
NetD3_2: P6.4 ; port Iin1_DSP
NetD4_2: P6.16 ; port Iin2_DSP
NetDAC1_2: P3.23 ; port MOSI
NetDAC1_4: P3.26 ; port GPIO
NetDAC1_19: P3.24 ; port SOMI
NetDigital_ISO1_3: Digital_ISO1.3(A1/in) P3.14 ; port Relay_ac_DSP
NetDigital_ISO1_4: Digital_ISO1.4(A2/in) P3.15 ; port Relay_dc_DSP
NetDigital_ISO1_5: Digital_ISO1.5(A3) P3.16 ; port Error_DSP
NetDigital_ISO1_7: Digital_ISO1.7(EN1) R45.2
NetDigital_ISO1_10: Digital_ISO1.10(EN2) R46.1
NetDigital_ISO1_12: Digital_ISO1.12(B3/in) P1.15 P1.16 TP9.1 ; port Error_Drive
NetDigital_ISO1_13: Digital_ISO1.13(B2) P1.1 P1.2 TP7.1 ; port Relay_dc_Drive
NetDigital_ISO1_14: Digital_ISO1.14(B1) P1.3 P1.4 TP5.1 ; port Relay_ac_Drive
NetLED1_1: LED1.1(A) R6.2
NetLED2_1: LED2.1(A) R7.2
NetLED3_1: LED3.1(A) R8.2
NetOPT3_2: OPT3.2 P3.9 ; port Q_P1-DSP
NetOPT3_3: OPT3.3 P3.11 ; port Q_P2-DSP
NetOPT3_4: OPT3.4 P3.10 ; port Q_S1-DSP
NetOPT3_5: OPT3.5 P3.12 ; port Q_S2-DSP
NetOPT3_6: OPT3.6 P3.13 ; port Switch_res_DSP
NetOPT3_10: OPT3.10 R36.2
NetOPT3_11: OPT3.11 P1.27 P1.28 TP2.1 ; port switch_res_Drive
NetOPT3_12: OPT3.12 P1.19 P1.20 TP18.1 ; port Q_S2_Driver
NetOPT3_13: OPT3.13 P1.13 P1.14 TP17.1 ; port Q_S1_Driver
NetOPT3_14: OPT3.14 P1.9 P1.10 TP14.1 ; port Q_P2_Driver
NetOPT3_15: OPT3.15 P1.7 P1.8 TP13.1 ; port Q_P1_Driver
NetP2_5: P2.5 ; port Iin1_sense
NetP2_6: P2.6 ; port In1_sense
NetP2_7: P2.7 ; port Iin2_sense
NetP2_8: P2.8 ; port In2_sense
NetP2_9: P2.9 P2.10 ; port Iout1_sense
NetP2_11: P2.11 P2.12 ; port Iout2_sense

Not connected (* = marked no-connect by the designer): Digital_ISO1 6(NC) 11(NC); OPT3 7; P3 1 2 3 4 5 6 7 8 17 18 21 22 27 28 29 30 31 32 33 37; P4 1 2 3 4; P5 2 3 4 5 6 7 8 9 10

### Notes on the sheet
- CUK 1Phase-digital Isolation and connectors
- Design by: Debanjan
- V1.1-1

### Library data of the parts
C27-C30 = Cap: Capacitor; Published: 8-Jun-2000; LatestRevisionDate: 17-Jul-2002; LatestRevisionNote: Re-released for DXP Platform.; PackageReference: RAD-0.3; Publisher: Altium Limited
Digital_ISO1 = Digital Isolator 2/1
LED1-LED3 = LED3: Typical BLUE SiC LED; Published: 8-Jun-2000; LatestRevisionDate: 17-Dec-2003; LatestRevisionNote: PCB Footprint replaced.; DatasheetDocument: 16-Apr-2002; PackageDocument: 16-Apr-2002; PackageReference: 3.5X2.8X1.9; Publisher: Altium Limited
OPT3 = digital isolator 16 pin
P1 = Header 15X2: Header, 15-Pin, Dual row; LatestRevisionDate: 17-Jul-2002; LatestRevisionNote: Re-released for DXP Platform.; Publisher: Altium Limited
P2 = Header 16X2: Header, 16-Pin, Dual row; LatestRevisionDate: 17-Jul-2002; LatestRevisionNote: Re-released for DXP Platform.; Publisher: Altium Limited
P3 = Header 20X2: Header, 20-Pin, Dual row; LatestRevisionDate: 17-Jul-2002; LatestRevisionNote: Re-released for DXP Platform.; Publisher: Altium Limited
P4 = Header 2X2: Header, 2-Pin, Dual row; LatestRevisionDate: 17-Jul-2002; LatestRevisionNote: Re-released for DXP Platform.; Publisher: Altium Limited
P5 = Header 10: Header, 10-Pin; LatestRevisionDate: 17-Jul-2002; LatestRevisionNote: Re-released for DXP Platform.; Publisher: Altium Limited
P6 = Header 10X2: Header, 10-Pin, Dual row; LatestRevisionDate: 17-Jul-2002; LatestRevisionNote: Re-released for DXP Platform.; Publisher: Altium Limited
R5-R8 R36 R45 R46 = Res1: Resistor; Published: 8-Jun-2000; Revision: July-2002: Re-released for DXP Platform.; Publisher: Altium Limited
SW1 = SW-PB: Switch; Published: 24-Mar-1999; Revision: July-2002: Re-released for DXP Platform.; Publisher: Altium Limited

## Nets that join several sheets
1.65_REFopamp: CUK_3Ph_Power_Supplys (R2.1 R4.2), CUK_3Ph_Analog_Isolation (U14.12)
12V_P: CUK_3Ph_Power_Supplys (6 pins), CUK_3Ph_dig_iso_interface (P1.11 P1.12)
-12: CUK_3Ph_Power_Supplys (C20.2 NMH2.4 U6.4), CUK_3Ph_dig_iso_interface (P1.23 P1.24)
DSP_3V3: CUK_3Ph_Power_Supplys (C21.1 C22.2 TP10.1 U7.3), DAC (DAC1.20 P7.2 R1.2 R3.2), CUK_3Ph_dig_iso_interface (6 pins)
DSP_5V: CUK_3Ph_Power_Supplys (C25.1 C26.2 TP11.1 U8.3), CUK_3Ph_sig_conditioner (C33.2 U9.4), CUK_3Ph_Analog_Isolation (7 pins), DAC (8 pins), CUK_3Ph_dig_iso_interface (P1.29 P1.30 P2.1 P2.2)
DSPGND: CUK_3Ph_Power_Supplys (11 pins), CUK_3Ph_sig_conditioner (14 pins), CUK_3Ph_Analog_Isolation (22 pins), DAC (20 pins), CUK_3Ph_dig_iso_interface (29 pins)
GND: CUK_3Ph_Power_Supplys (16 pins), CUK_3Ph_Analog_Isolation (10 pins), CUK_3Ph_dig_iso_interface (15 pins)
GND_S: CUK_3Ph_Power_Supplys (10 pins), CUK_3Ph_Analog_Isolation (18 pins), CUK_3Ph_dig_iso_interface (P2.19 P2.20 P2.25 P2.26)
P5V: CUK_3Ph_Power_Supplys (C3.1 C4.2 TP1.1 U1.1), CUK_3Ph_Analog_Isolation (C39.2 R19.1 R34.1 U10.4), CUK_3Ph_dig_iso_interface (6 pins)
P-5V: CUK_3Ph_Power_Supplys (C8.2 C9.1 TP4.1 U3.3), CUK_3Ph_Analog_Isolation (C42.2 U10.11)
S5V: CUK_3Ph_Power_Supplys (5 pins), CUK_3Ph_Analog_Isolation (7 pins)
S-5V: CUK_3Ph_Power_Supplys (C18.2 C19.1 TP8.1 U6.3), CUK_3Ph_Analog_Isolation (C48.2 C60.2 U12.11 U14.11)
x1: DAC (DAC1.3), CUK_3Ph_dig_iso_interface (P3.25)
NetC38_2: CUK_3Ph_Analog_Isolation (C38.2 D6.2 R17.2 U11.1), CUK_3Ph_dig_iso_interface (P6.14)
NetC41_1: CUK_3Ph_Analog_Isolation (C41.1 D5.2 U10.3), CUK_3Ph_dig_iso_interface (P2.27 P2.28)
NetC44_2: CUK_3Ph_Analog_Isolation (C44.2 D8.2 R20.2 U11.7), CUK_3Ph_dig_iso_interface (P6.8)
NetC47_1: CUK_3Ph_Analog_Isolation (C47.1 D7.2 U12.3), CUK_3Ph_dig_iso_interface (P2.21 P2.22)
NetC50_2: CUK_3Ph_Analog_Isolation (C50.2 D10.2 R24.2 U11.8), CUK_3Ph_dig_iso_interface (P6.10)
NetC51_1: CUK_3Ph_Analog_Isolation (C51.1 D9.2 U12.10), CUK_3Ph_dig_iso_interface (P2.23 P2.24)
NetC52_1: CUK_3Ph_Analog_Isolation (C52.1 R27.2 U14.9), CUK_3Ph_dig_iso_interface (P2.17 P2.18)
NetC53_2: CUK_3Ph_Analog_Isolation (C53.2 D11.2 R26.2 U13.14), CUK_3Ph_dig_iso_interface (P6.12)
NetC57_1: CUK_3Ph_Analog_Isolation (C57.1 R31.2 U14.10), CUK_3Ph_dig_iso_interface (P2.15 P2.16)
NetC58_2: CUK_3Ph_Analog_Isolation (C58.2 D13.2 R32.2 U11.14), CUK_3Ph_dig_iso_interface (P5.1)
NetC61_1: CUK_3Ph_Analog_Isolation (C61.1 D12.2 U10.12), CUK_3Ph_dig_iso_interface (P2.31 P2.32)
NetD1_2: CUK_3Ph_sig_conditioner (D1.2 U9.1 U9.2), CUK_3Ph_dig_iso_interface (P6.6)
NetD2_2: CUK_3Ph_sig_conditioner (D2.2 U9.6 U9.7), CUK_3Ph_dig_iso_interface (P6.2)
NetD3_2: CUK_3Ph_sig_conditioner (D3.2 U9.8 U9.9), CUK_3Ph_dig_iso_interface (P6.4)
NetD4_2: CUK_3Ph_sig_conditioner (D4.2 U9.13 U9.14), CUK_3Ph_dig_iso_interface (P6.16)
NetDAC1_2: DAC (DAC1.2 R1.1 TP26.1), CUK_3Ph_dig_iso_interface (P3.23)
NetDAC1_4: DAC (DAC1.4), CUK_3Ph_dig_iso_interface (P3.26)
NetDAC1_19: DAC (DAC1.19 R3.1), CUK_3Ph_dig_iso_interface (P3.24)
NetP2_5: CUK_3Ph_sig_conditioner (R13.2), CUK_3Ph_dig_iso_interface (P2.5)
NetP2_7: CUK_3Ph_sig_conditioner (R14.2), CUK_3Ph_dig_iso_interface (P2.7)
NetP2_9: CUK_3Ph_sig_conditioner (R9.2), CUK_3Ph_dig_iso_interface (P2.9 P2.10)
NetP2_11: CUK_3Ph_sig_conditioner (R10.2), CUK_3Ph_dig_iso_interface (P2.11 P2.12)